# Altium schematic sheet position_sensors.SchDoc
size 420 x 297 mm; SheetNumber: 2
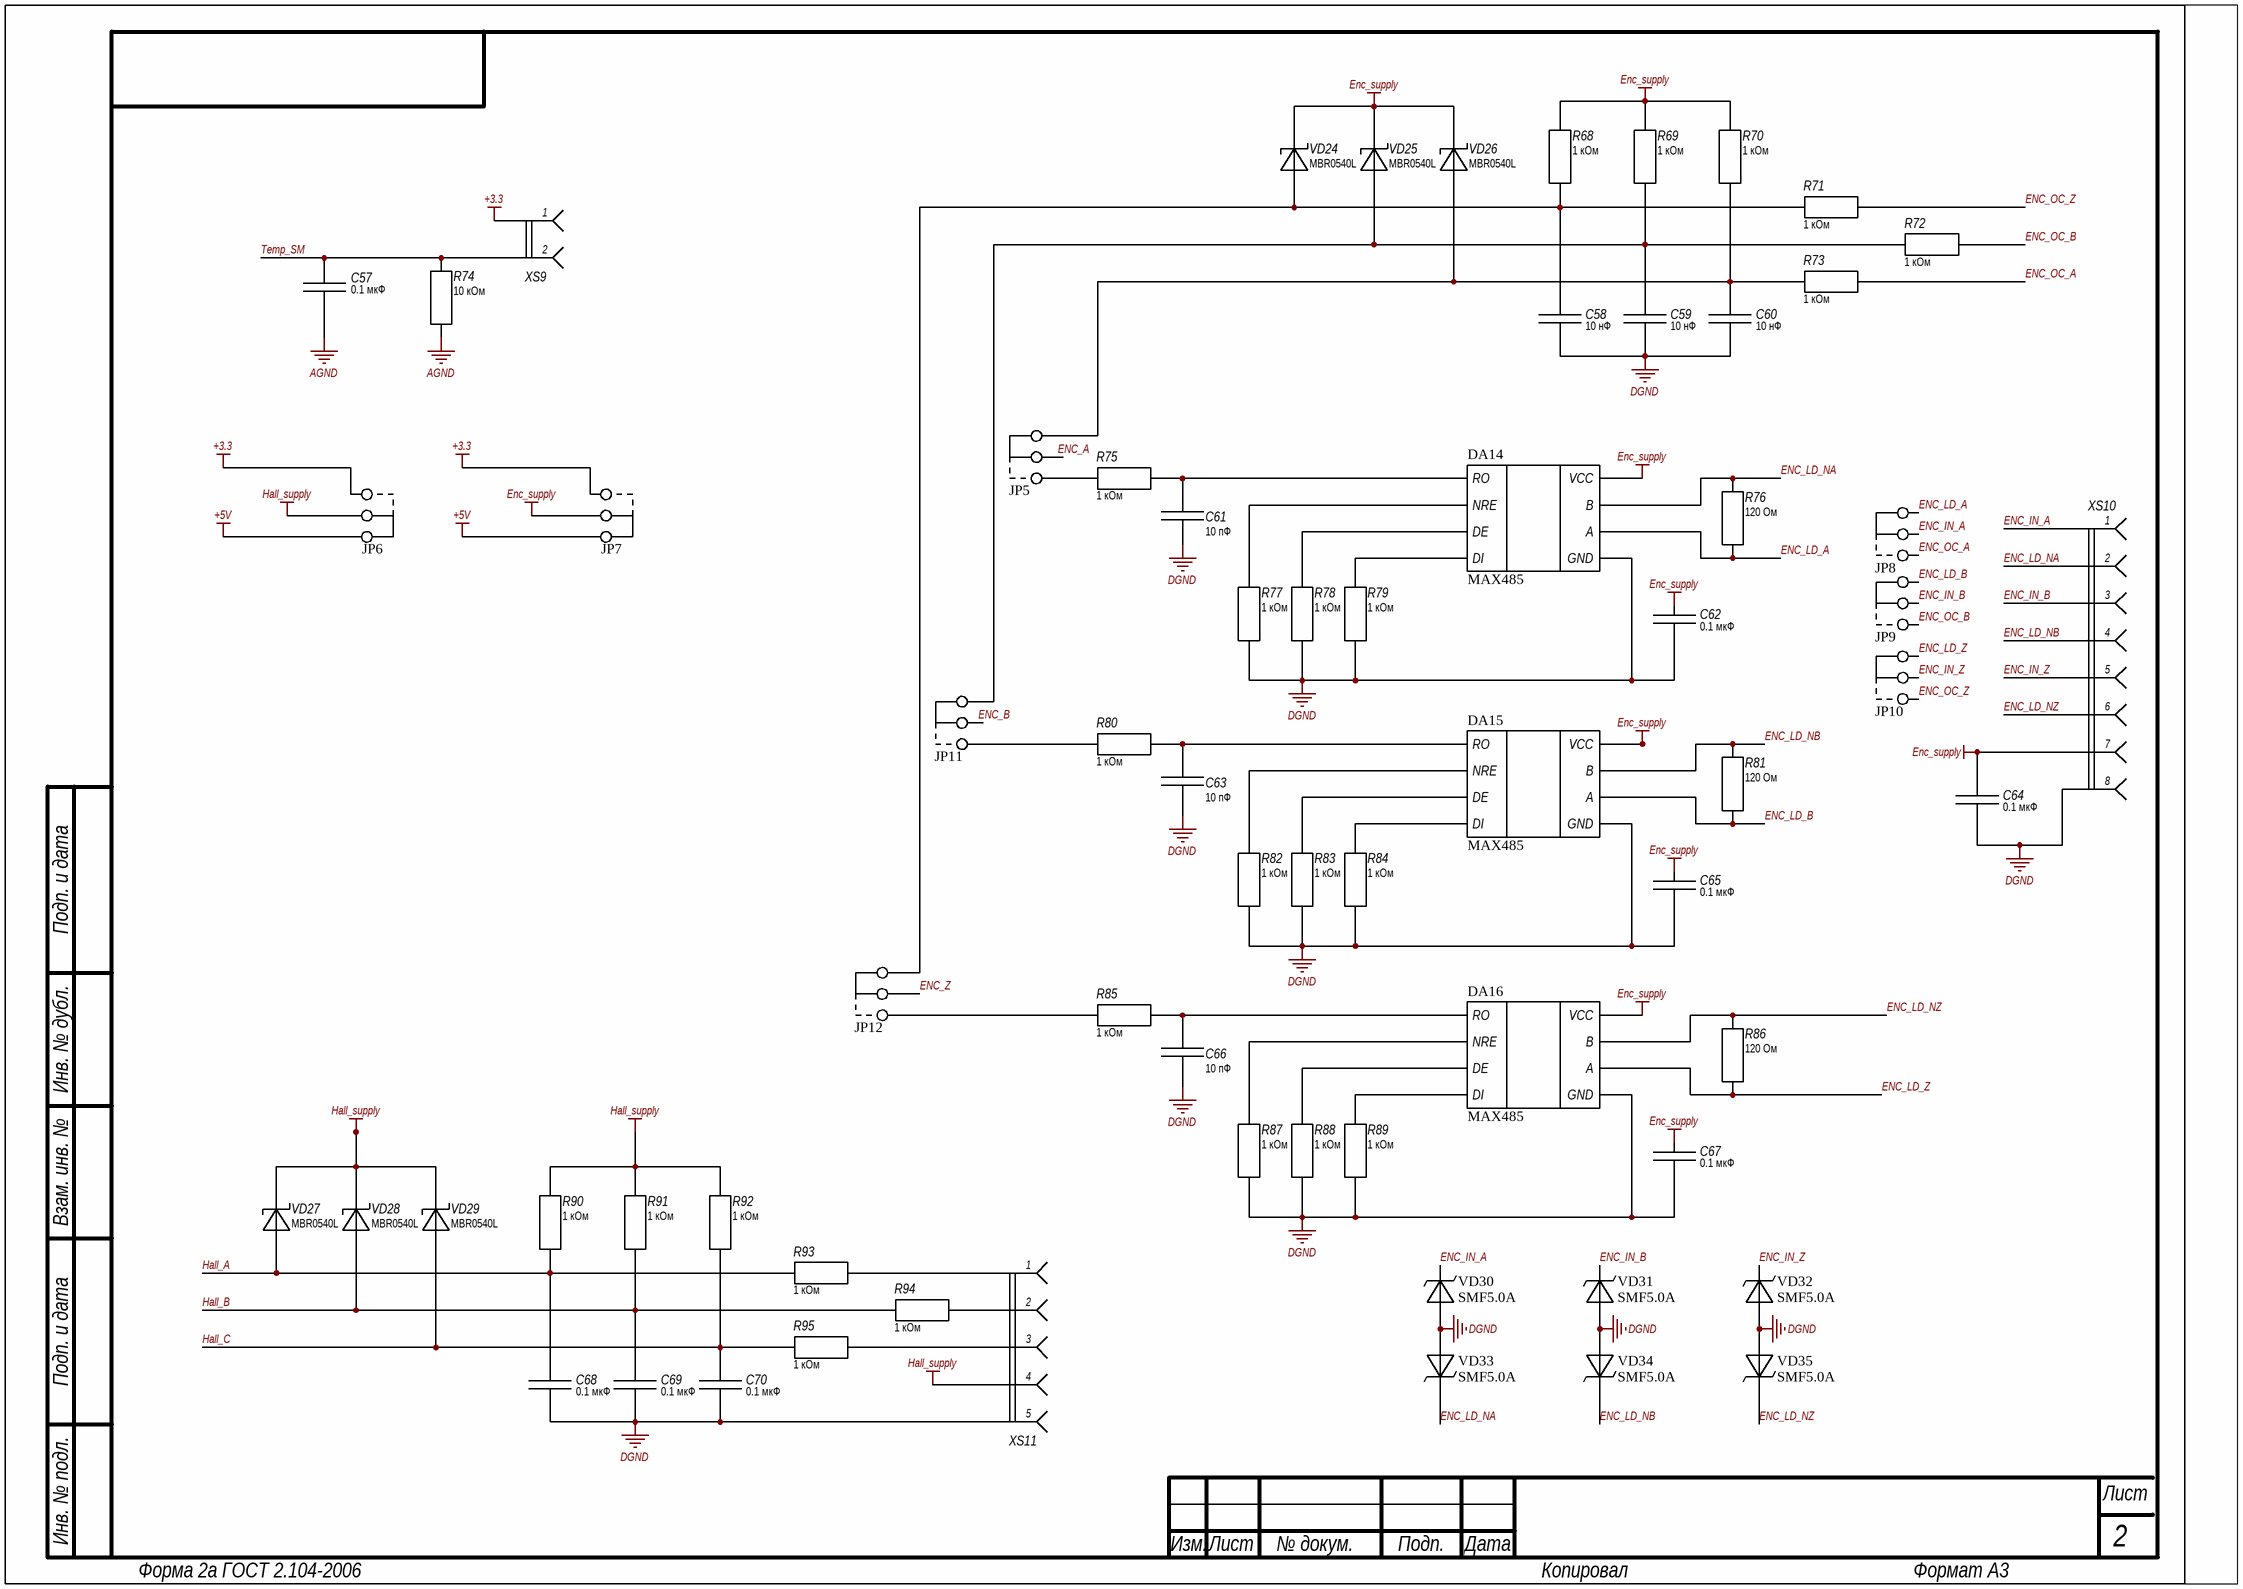
[diagram p0: position_sensors.SchDoc]

## Parts
C57  value 0.1 мкФ  [CC0805]  (hidden comment: Capacitor)
C58  value 10 нФ  [CC0805]  (hidden comment: Capacitor)
C59  value 10 нФ  [CC0805]  (hidden comment: Capacitor)
C60  value 10 нФ  [CC0603]  (hidden comment: Capacitor)
C61  value 10 пФ  [CC0603]  (hidden comment: Capacitor)
C62  value 0.1 мкФ  [CC0603]  (hidden comment: Capacitor)
C63  value 10 пФ  [CC0603]  (hidden comment: Capacitor)
C64  value 0.1 мкФ  [CC0603]  (hidden comment: Capacitor)
C65  value 0.1 мкФ  [CC0603]  (hidden comment: Capacitor)
C66  value 10 пФ  [CC0603]  (hidden comment: Capacitor)
C67  value 0.1 мкФ  [CC0603]  (hidden comment: Capacitor)
C68  value 0.1 мкФ  [CC0805]  (hidden comment: Capacitor)
C69  value 0.1 мкФ  [CC0805]  (hidden comment: Capacitor)
C70  value 0.1 мкФ  [CC0805]  (hidden comment: Capacitor)
DA14  MAX485  [SO8]
DA15  MAX485  [SO8]
DA16  MAX485  [SO8]
JP5  Jumper  [PLS3]  (value not drawn)
JP6  Jumper  [PLS3]  (value not drawn)
JP7  Jumper  [PLS3]  (value not drawn)
JP8  Jumper  [PLS3]  (value not drawn)
JP9  Jumper  [PLS3]  (value not drawn)
JP10  Jumper  [PLS3]  (value not drawn)
JP11  Jumper  [PLS3]  (value not drawn)
JP12  Jumper  [PLS3]  (value not drawn)
R68  value 1 кОм  [RC1206]  (hidden comment: Resistor)
R69  value 1 кОм  [RC1206]  (hidden comment: Resistor)
R70  value 1 кОм  [RC1206]  (hidden comment: Resistor)
R71  value 1 кОм  [RC1206]  (hidden comment: Resistor)
R72  value 1 кОм  [RC1206]  (hidden comment: Resistor)
R73  value 1 кОм  [RC1206]  (hidden comment: Resistor)
R74  value 10 кОм  [RC0805]  (hidden comment: Resistor)
R75  value 1 кОм  [RC0603]  (hidden comment: Resistor)
R76  value 120 Ом  [RC1206]  (hidden comment: Resistor)
R77  value 1 кОм  [RC0603]  (hidden comment: Resistor)
R78  value 1 кОм  [RC0603]  (hidden comment: Resistor)
R79  value 1 кОм  [RC0603]  (hidden comment: Resistor)
R80  value 1 кОм  [RC0603]  (hidden comment: Resistor)
R81  value 120 Ом  [RC1206]  (hidden comment: Resistor)
R82  value 1 кОм  [RC0603]  (hidden comment: Resistor)
R83  value 1 кОм  [RC0603]  (hidden comment: Resistor)
R84  value 1 кОм  [RC0603]  (hidden comment: Resistor)
R85  value 1 кОм  [RC0603]  (hidden comment: Resistor)
R86  value 120 Ом  [RC1206]  (hidden comment: Resistor)
R87  value 1 кОм  [RC0603]  (hidden comment: Resistor)
R88  value 1 кОм  [RC0603]  (hidden comment: Resistor)
R89  value 1 кОм  [RC0603]  (hidden comment: Resistor)
R90  value 1 кОм  [RC1206]  (hidden comment: Resistor)
R91  value 1 кОм  [RC1206]  (hidden comment: Resistor)
R92  value 1 кОм  [RC1206]  (hidden comment: Resistor)
R93  value 1 кОм  [RC1206]  (hidden comment: Resistor)
R94  value 1 кОм  [RC1206]  (hidden comment: Resistor)
R95  value 1 кОм  [RC1206]  (hidden comment: Resistor)
VD24  MBR0540L  [SOD123]
VD25  MBR0540L  [SOD123]
VD26  MBR0540L  [SOD123]
VD27  MBR0540L  [SOD123]
VD28  MBR0540L  [SOD123]
VD29  MBR0540L  [SOD123]
VD30  SMF5.0A  [D0-124AC]
VD31  SMF5.0A  [D0-124AC]
VD32  SMF5.0A  [D0-124AC]
VD33  SMF5.0A  [D0-124AC]
VD34  SMF5.0A  [D0-124AC]
VD35  SMF5.0A  [D0-124AC]
XS9  JST-Male-2  [JST-2]  (value not drawn)
XS10  DG141V-2.54-05P-14-00AH  [DG141V-2.54-08P]  (value not drawn)
XS11  DG141V-2.54-05P-14-00AH  [DG141V-2.54-05P]  (value not drawn)

## Nets
+3.3: JP6.1 JP7.1 XS9.1
+5V: JP6.3 JP7.3
AGND: C57.1 R74.2
DGND: C58.1 C59.1 C60.1 C61.2 C62.1 C63.2 C64.1 C65.1 C66.2 C67.1 C68.1 C69.1 C70.1 DA14.8(GND) DA15.8(GND) DA16.8(GND) R77.2 R78.2 R79.2 R82.2 R83.2 R84.2 R87.2 R88.2 R89.2 VD30.A VD31.A VD32.A VD33.A VD34.A VD35.A XS10.8 XS11.5
Enc_supply: C62.2 C64.2 C65.2 C67.2 DA14.5(VCC) DA15.5(VCC) DA16.5(VCC) JP7.2 R68.2 R69.2 R70.2 VD24.C VD25.C VD26.C XS10.7
Hall_supply: JP6.2 R90.2 R91.2 R92.2 VD27.C VD28.C VD29.C XS11.4
ENC_A: JP5.2
ENC_B: JP11.2
ENC_IN_A: JP8.2 VD30.C XS10.1
ENC_IN_B: JP9.2 VD31.C XS10.3
ENC_IN_Z: JP10.2 VD32.C XS10.5
ENC_LD_A: DA14.7(A) JP8.3 R76.1
ENC_LD_B: DA15.7(A) JP9.3 R81.1
ENC_LD_NA: DA14.6(B) R76.2 VD33.C XS10.2
ENC_LD_NB: DA15.6(B) R81.2 VD34.C XS10.4
ENC_LD_NZ: DA16.6(B) R86.2 VD35.C XS10.6
ENC_LD_Z: DA16.7(A) JP10.3 R86.1
ENC_OC_A: JP8.1 R73.2
ENC_OC_B: JP9.1 R72.2
ENC_OC_Z: JP10.1 R71.2
ENC_Z: JP12.2
Hall_A: C68.2 R90.1 R93.1 VD27.A
Hall_B: C69.2 R91.1 R94.1 VD28.A
Hall_C: C70.2 R92.1 R95.1 VD29.A
Temp_SM: C57.2 R74.1 XS9.2
NetC58_2: C58.2 JP12.3 R68.1 R71.1 VD24.A
NetC59_2: C59.2 JP11.3 R69.1 R72.1 VD25.A
NetC60_2: C60.2 JP5.3 R70.1 R73.1 VD26.A
NetC61_1: C61.1 DA14.1(RO) R75.1
NetC63_1: C63.1 DA15.1(RO) R80.1
NetC66_1: C66.1 DA16.1(RO) R85.1
NetDA14_2: DA14.2(NRE) R77.1
NetDA14_3: DA14.3(DE) R78.1
NetDA14_4: DA14.4(DI) R79.1
NetDA15_2: DA15.2(NRE) R82.1
NetDA15_3: DA15.3(DE) R83.1
NetDA15_4: DA15.4(DI) R84.1
NetDA16_2: DA16.2(NRE) R87.1
NetDA16_3: DA16.3(DE) R88.1
NetDA16_4: DA16.4(DI) R89.1
NetJP5_1: JP5.1 R75.2
NetJP11_1: JP11.1 R80.2
NetJP12_1: JP12.1 R85.2
NetR93_2: R93.2 XS11.1
NetR94_2: R94.2 XS11.2
NetR95_2: R95.2 XS11.3

## Notes on the sheet
- Подп. и дата
- Инв. № дубл.
- Взам. инв. №
- Инв. № подл.
- Изм.
- Лист
- № докум.
- Подп.
- Дата
- Форма 2а ГОСТ 2.104-2006
- Копировал
- Формат А3

## Library data of the parts
C57 = Capacitor: Voltage: 50 В; ComponentLink1Description: Product link; ComponentLink1URL: *; Name: CC0805; GOST_Name_1: =Name; GOST_Name_2: 50 В; GOST_Name_3: 0.1 мкФ; GOST_Name_0: -
C58 C59 C62 C64 C65 C67 = Capacitor: Voltage: 16В; ComponentLink1Description: Product link; ComponentLink1URL: *; GOST_Name_1: =Name; GOST_Name_2: 16В; GOST_Name_0: -
  C58 C59: Name: CC0805; GOST_Name_3: 10 нФ
  C62 C64 C65 C67: Name: CC0603; GOST_Name_3: 0.1 мкФ
C60 C61 C63 C66 C68-C70 = Capacitor: Voltage: 50В; ComponentLink1Description: Product link; ComponentLink1URL: *; GOST_Name_1: =Name; GOST_Name_2: 50В; GOST_Name_0: -
  C60: Name: CC0603; GOST_Name_3: 10 нФ
  C61 C63 C66: Name: CC0603; GOST_Name_3: 10 пФ
  C68-C70: Name: CC0805; GOST_Name_3: 0.1 мкФ
DA14-DA16 = MAX485ESA: GOST_Name_1: MAX485ESA+ ф. Maxim Integrated; ComponentLink1Description: Product link; ComponentLink1URL: https://www.platan.ru/cgi-bin/qwery.pl/id=355590810; Datasheet: https://doc.platan.ru/pdf/datasheets/maxim/MAX1487E-MAX491E-101921.pdf
R68-R73 R76 R81 R86 R90-R95 = Resistor: Power: 250 мВт; ComponentLink1Description: Product link; ComponentLink1URL: *; Name: RC1206; GOST_Name_1: =Name; GOST_Name_2: 250 мВт; GOST_Name_0: -
  R68-R73 R90-R95: GOST_Name_3: 1 кОм
  R76 R81 R86: GOST_Name_3: 120 Ом
R74 = Resistor: Power: 125 мВт; ComponentLink1Description: Product link; ComponentLink1URL: *; Name: RC0805; GOST_Name_1: =Name; GOST_Name_2: 125 мВт; GOST_Name_3: 10 кОм; GOST_Name_0: -
R75 R80 R85 = Resistor: Power: 100мВт; ComponentLink1Description: Product link; ComponentLink1URL: *; Name: RC0603; GOST_Name_1: =Name; GOST_Name_2: 100мВт; GOST_Name_3: 1 кОм; GOST_Name_0: -
R77-R79 R82-R84 R87-R89 = Resistor: Power: 100 мВт; ComponentLink1Description: Product link; ComponentLink1URL: *; Name: RC0603; GOST_Name_1: =Name; GOST_Name_2: 100 мВт; GOST_Name_3: 1 кОм; GOST_Name_0: -
VD24-VD29 = Shotki: Name: MBR0540L, 40В, 0.5А, ф. Hottech; ComponentLink1Description: Product link; GOST_Name_1: MBR0540L, 40В, 0.5А, ф. Hottech
VD30-VD35 = TVS Diode: GOST_Name_1: SMF5.0A, Диод защитный 5В 200Вт; ComponentLink1Description: Product link
  VD30: ComponentLink1URL: https://www.chipdip.ru/product/smf5.0a-umw
XS9 = JST-Male-2: Name: JST-2.54 x2; GOST_Name_1: JST-2.54 x2
XS10 = DG141V-2.54-08P-14-00A(H): Name: DG141V-2.54-08P-14-00A(H), ф. Degson Electronics Co; ComponentLink1Description: Product link; ComponentLink1URL: https://www.promelec.ru/product/102606/; GOST_Name_1: DG141V-2.54-08P-14-00A(H), ф. Degson Electronics Co
XS11 = DG141V-2.54-05P-14-00AH: Name: DG141V-2.54-05P-14-00AH, ф. Degson Electronics Co; ComponentLink1Description: Product link; ComponentLink1URL: https://www.promelec.ru/product/403282/; GOST_Name_1: DG141V-2.54-05P-14-00AH, ф. Degson Electronics Co
JP5-JP12 = Jumper: ComponentLink1Description: Product link; ComponentLink1URL: https://www.chipdip.ru/product/stps2h100a-2